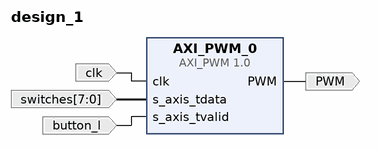
[diagram p0: block diagram of the top level]
# Vivado block design design_1, Vivado 2016.2
create_bd_design design_1

create_bd_port -dir O PWM
create_bd_port -dir I -type clk clk
create_bd_port -dir I -from 7 -to 0 switches
create_bd_port -dir I button_l

create_bd_cell -type ip -vlnv user.org:user:AXI_PWM:1.0 AXI_PWM_0

# ---- connections ----

connect_bd_net [get_bd_pins AXI_PWM_0/PWM] [get_bd_ports PWM]
connect_bd_net [get_bd_ports clk] [get_bd_pins AXI_PWM_0/clk]
connect_bd_net [get_bd_ports switches] [get_bd_pins AXI_PWM_0/s_axis_tdata]
connect_bd_net [get_bd_ports button_l] [get_bd_pins AXI_PWM_0/s_axis_tvalid]

validate_bd_design
save_bd_design
